# EasyEDA Pro project ProPrj_嵌赛国赛_2025-08-15.epro, schematic Schematic6

## Sheets
1 P1: Board Name: 审核板子; Create Date: 2025-07-23; Page Name: P1; Project Name: 嵌赛国赛; Schematic Name: Schematic6; Update Date: 2025-07-24; Company: 嘉立创EDA; Page Size: A4; Version: V1.0
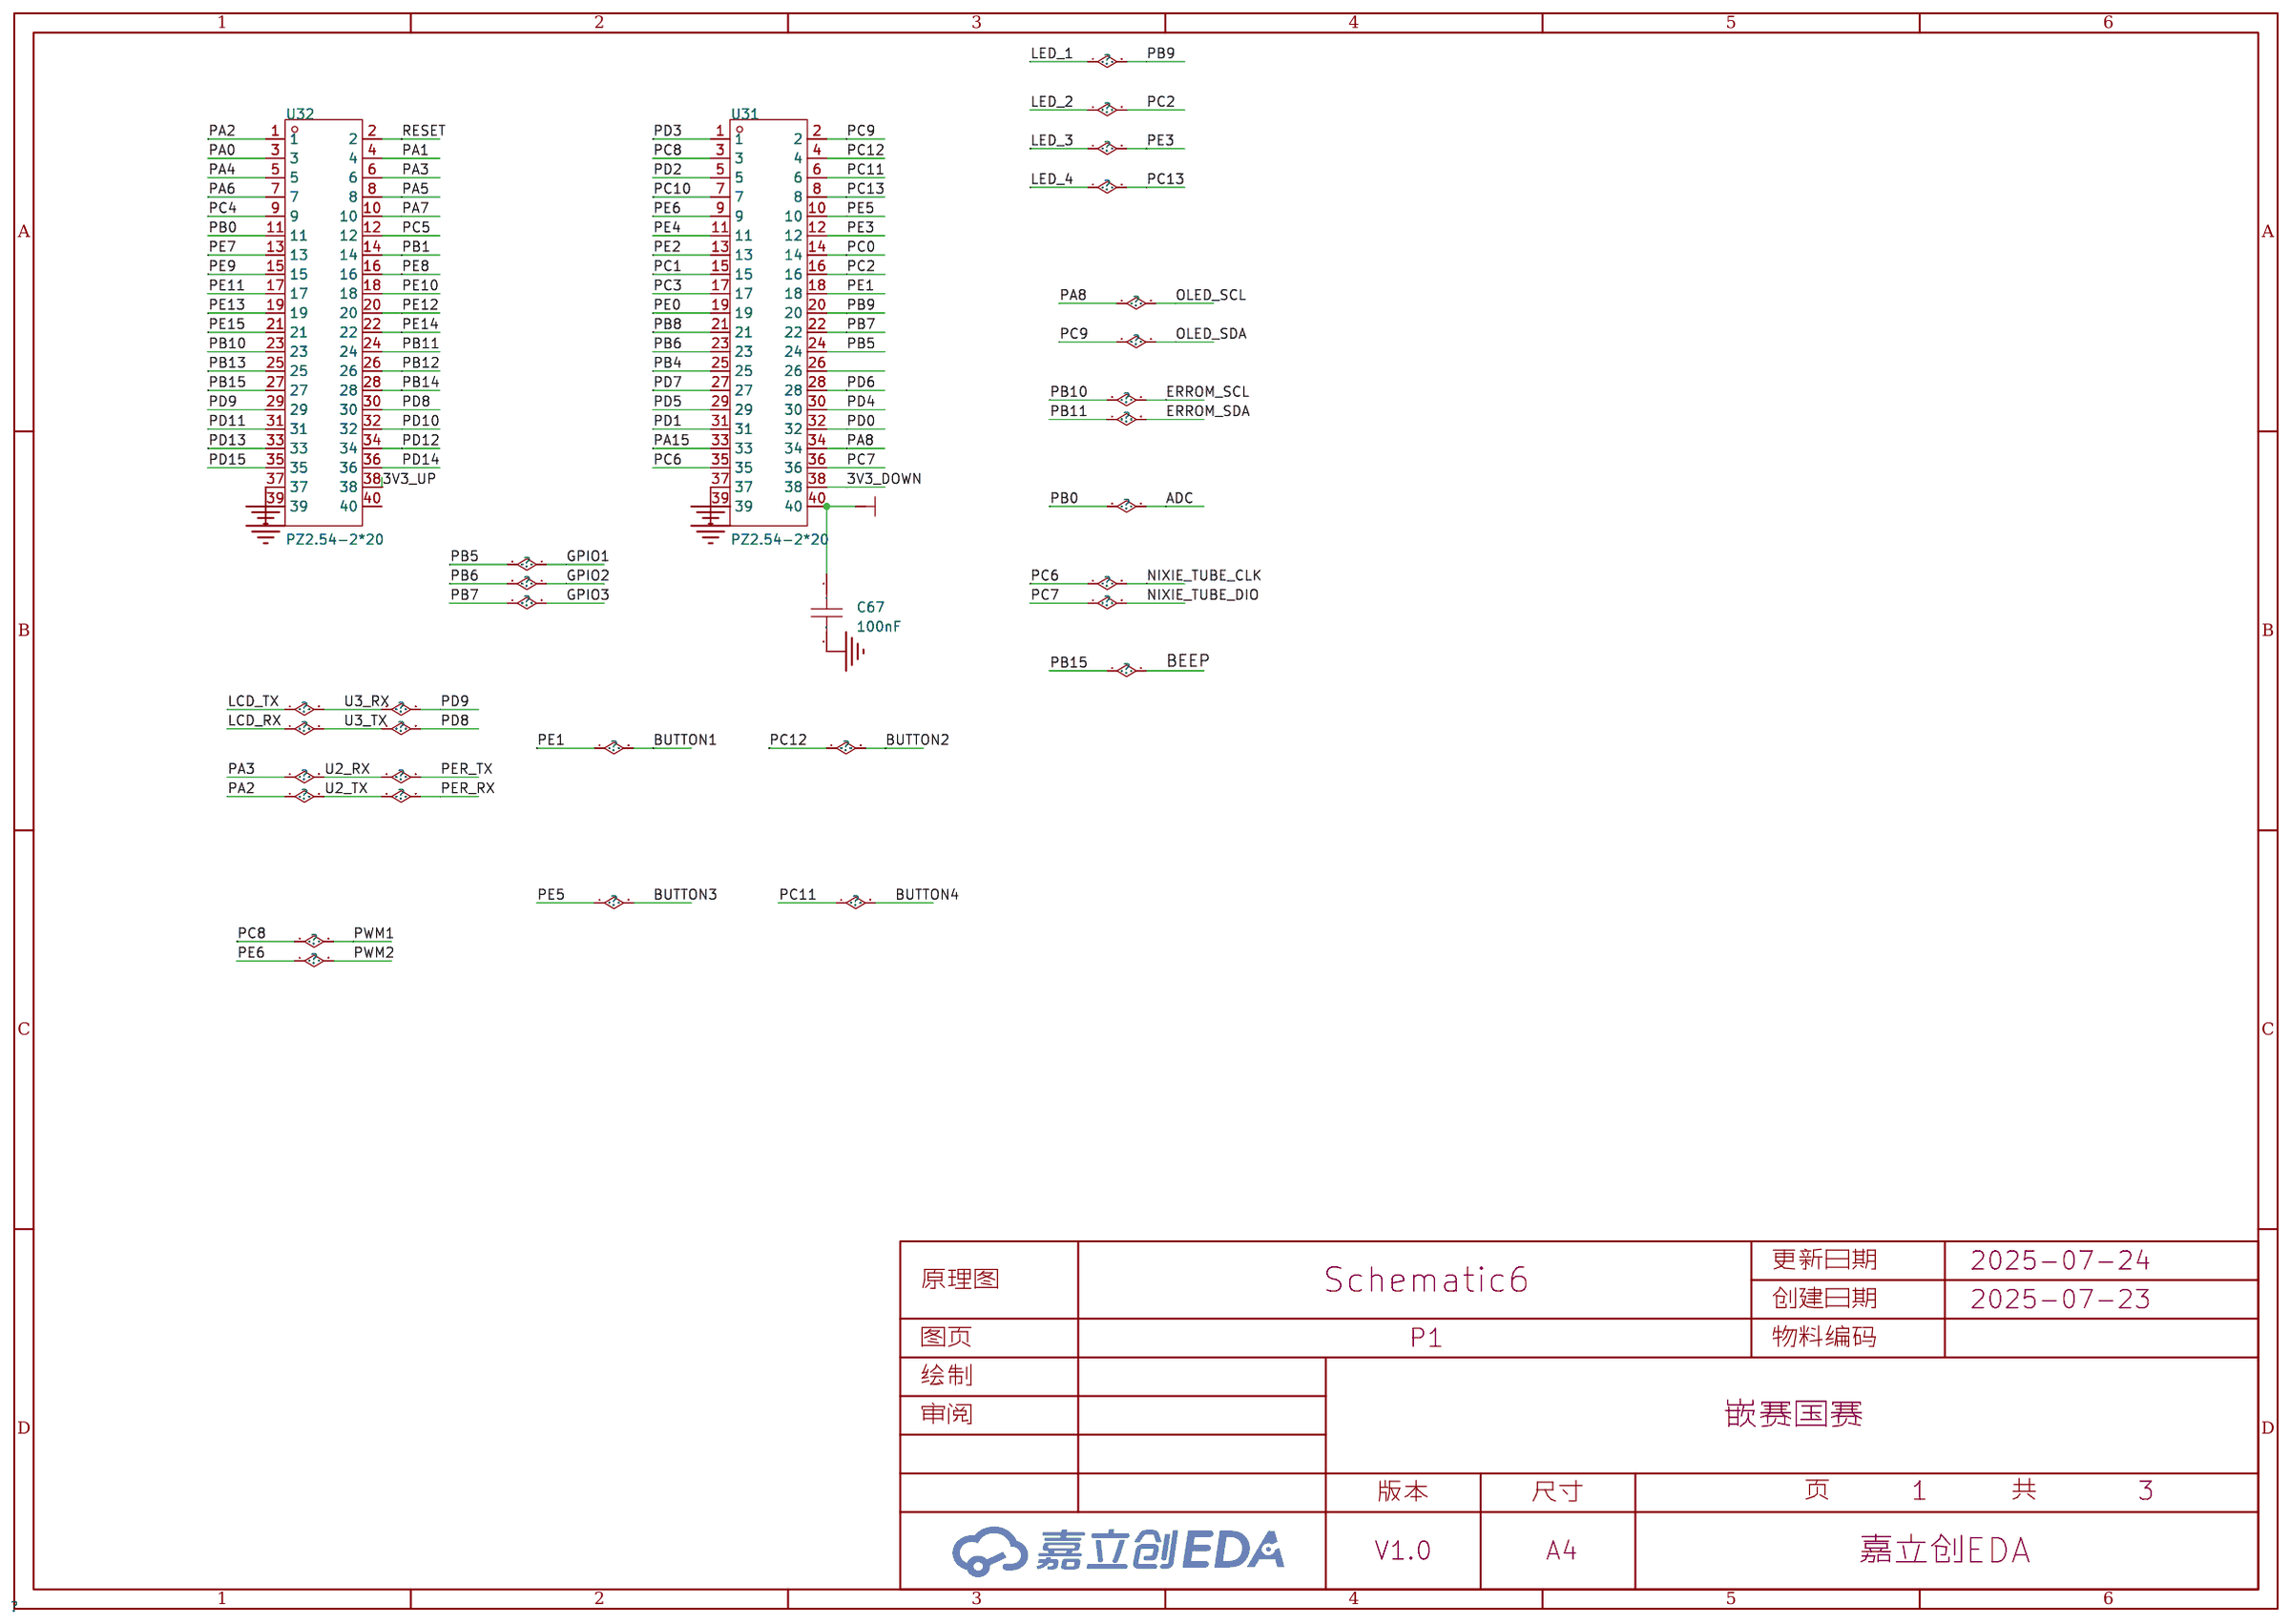
[diagram p11: P1]
2 外设: Page Name: 外设
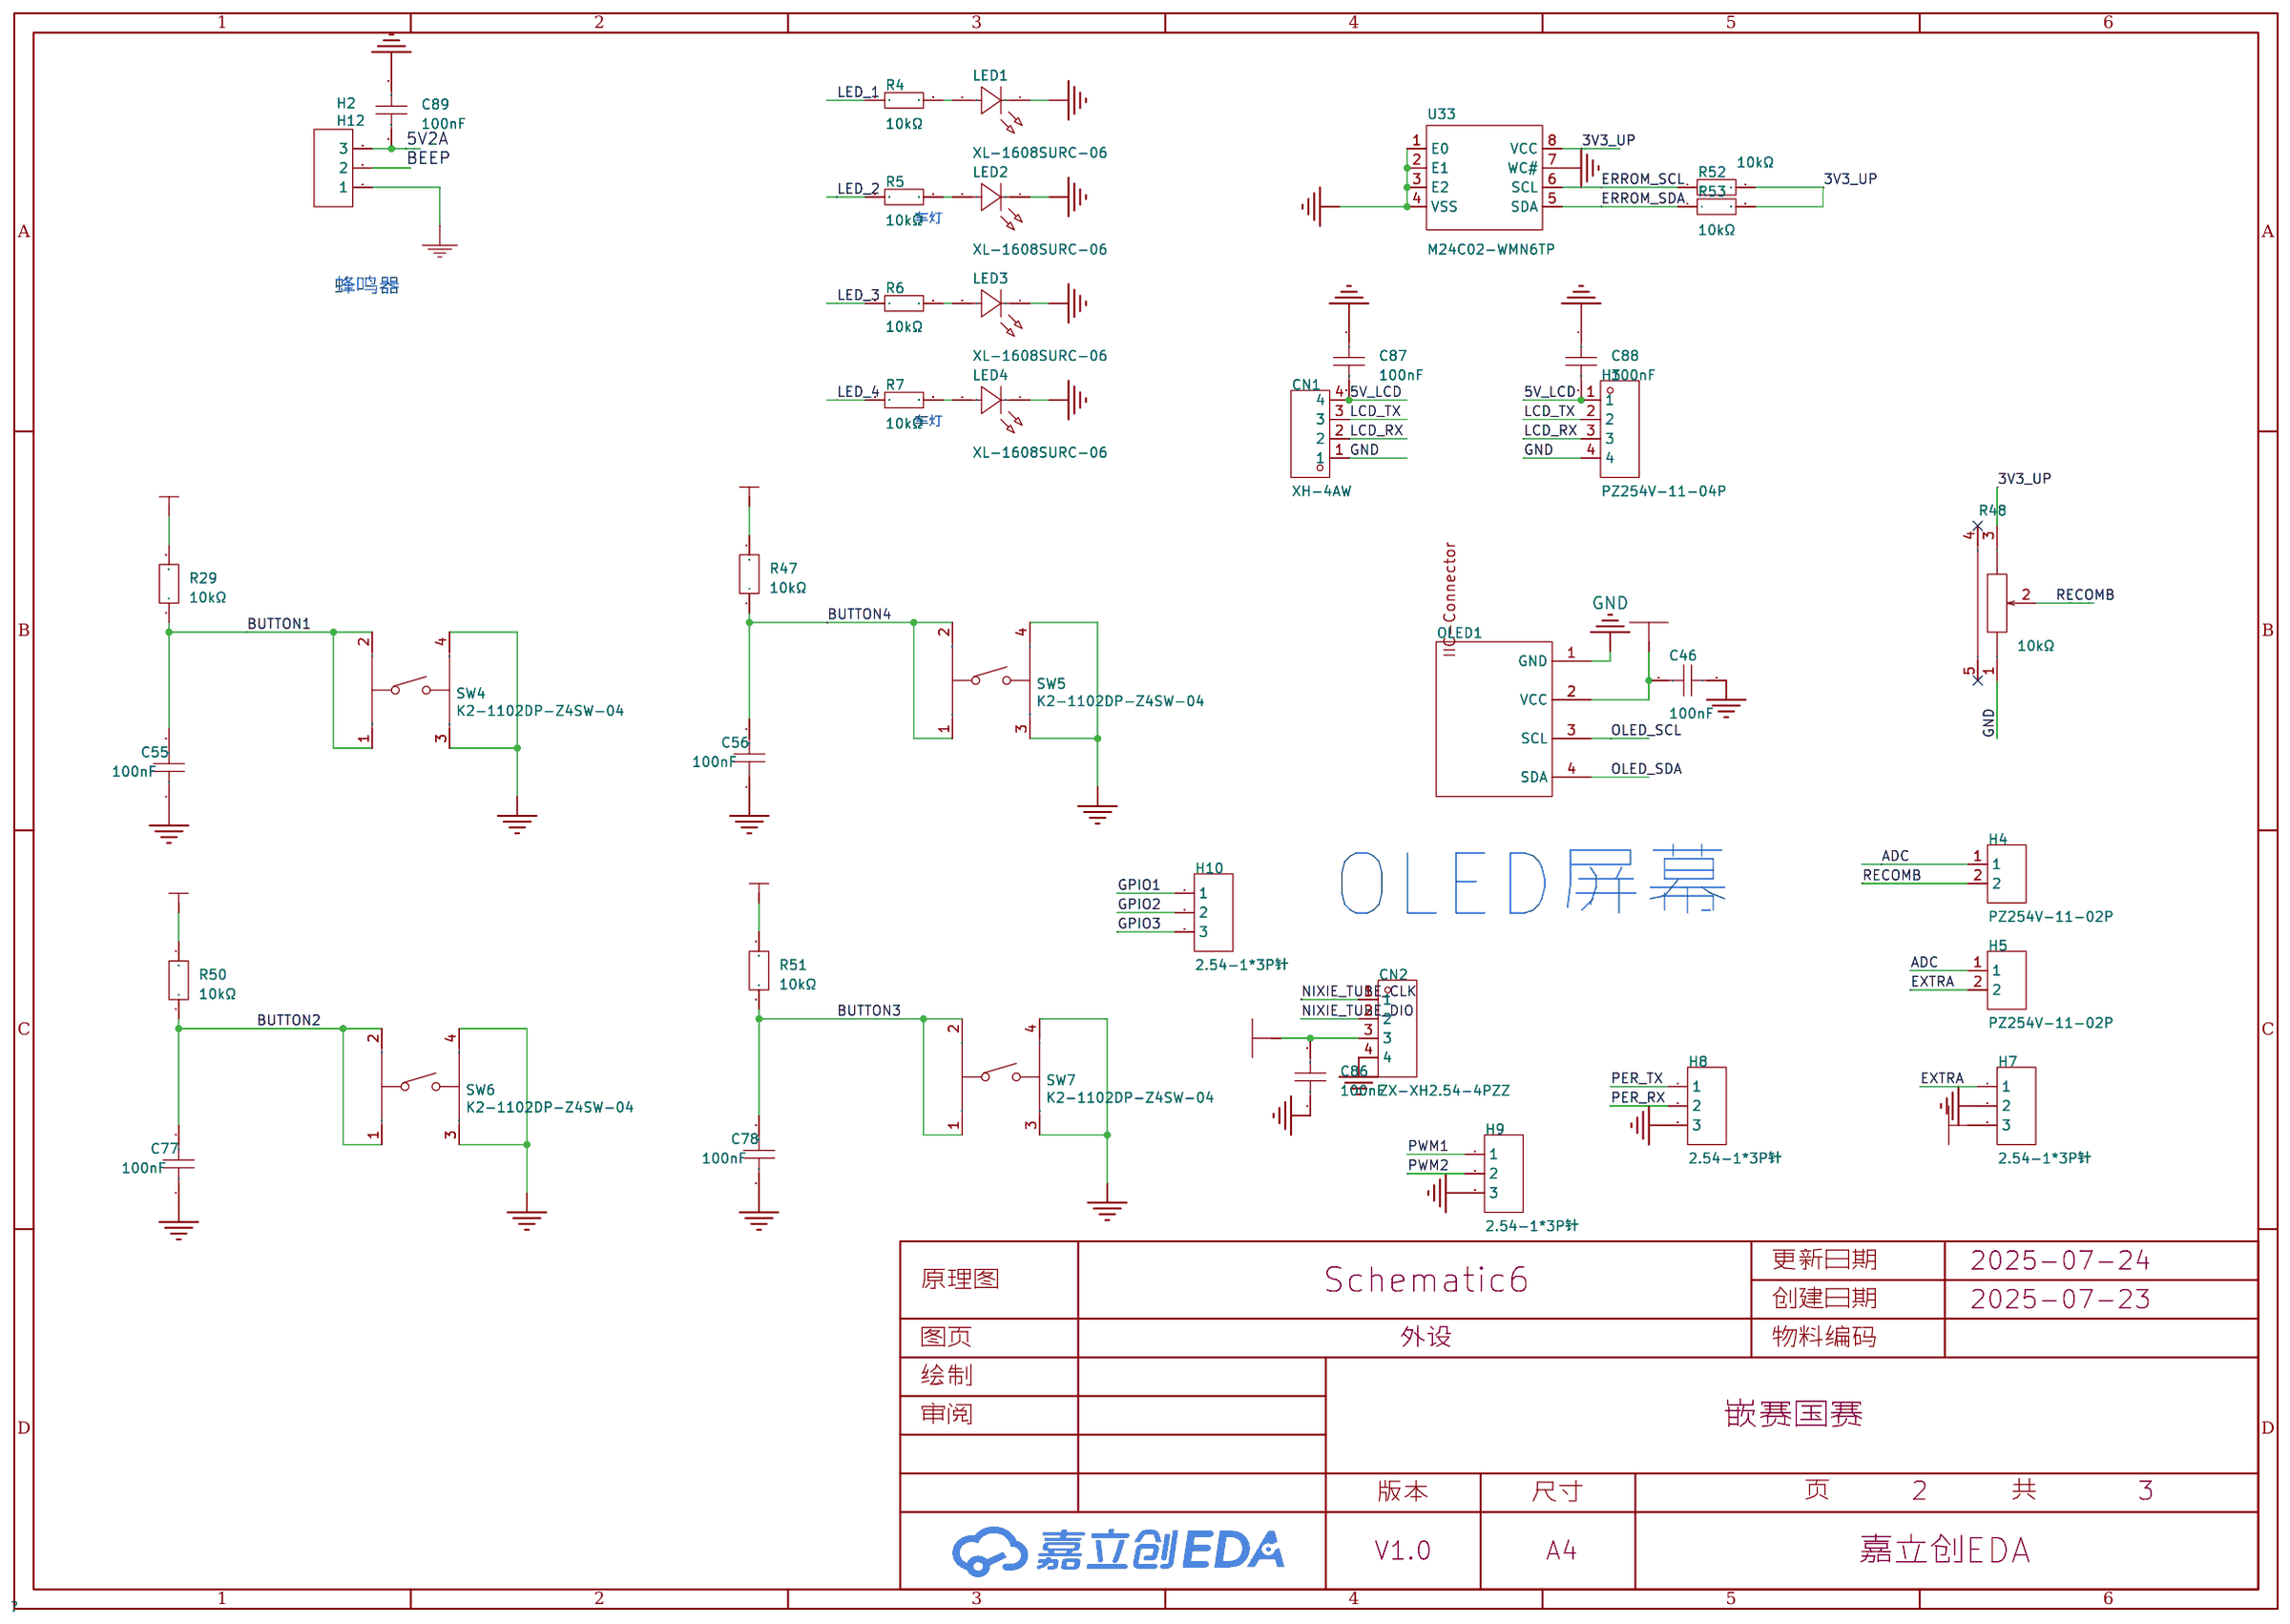
[diagram p12: 外设]
3 P3: Page Name: P3; Update Date: 2025-07-23
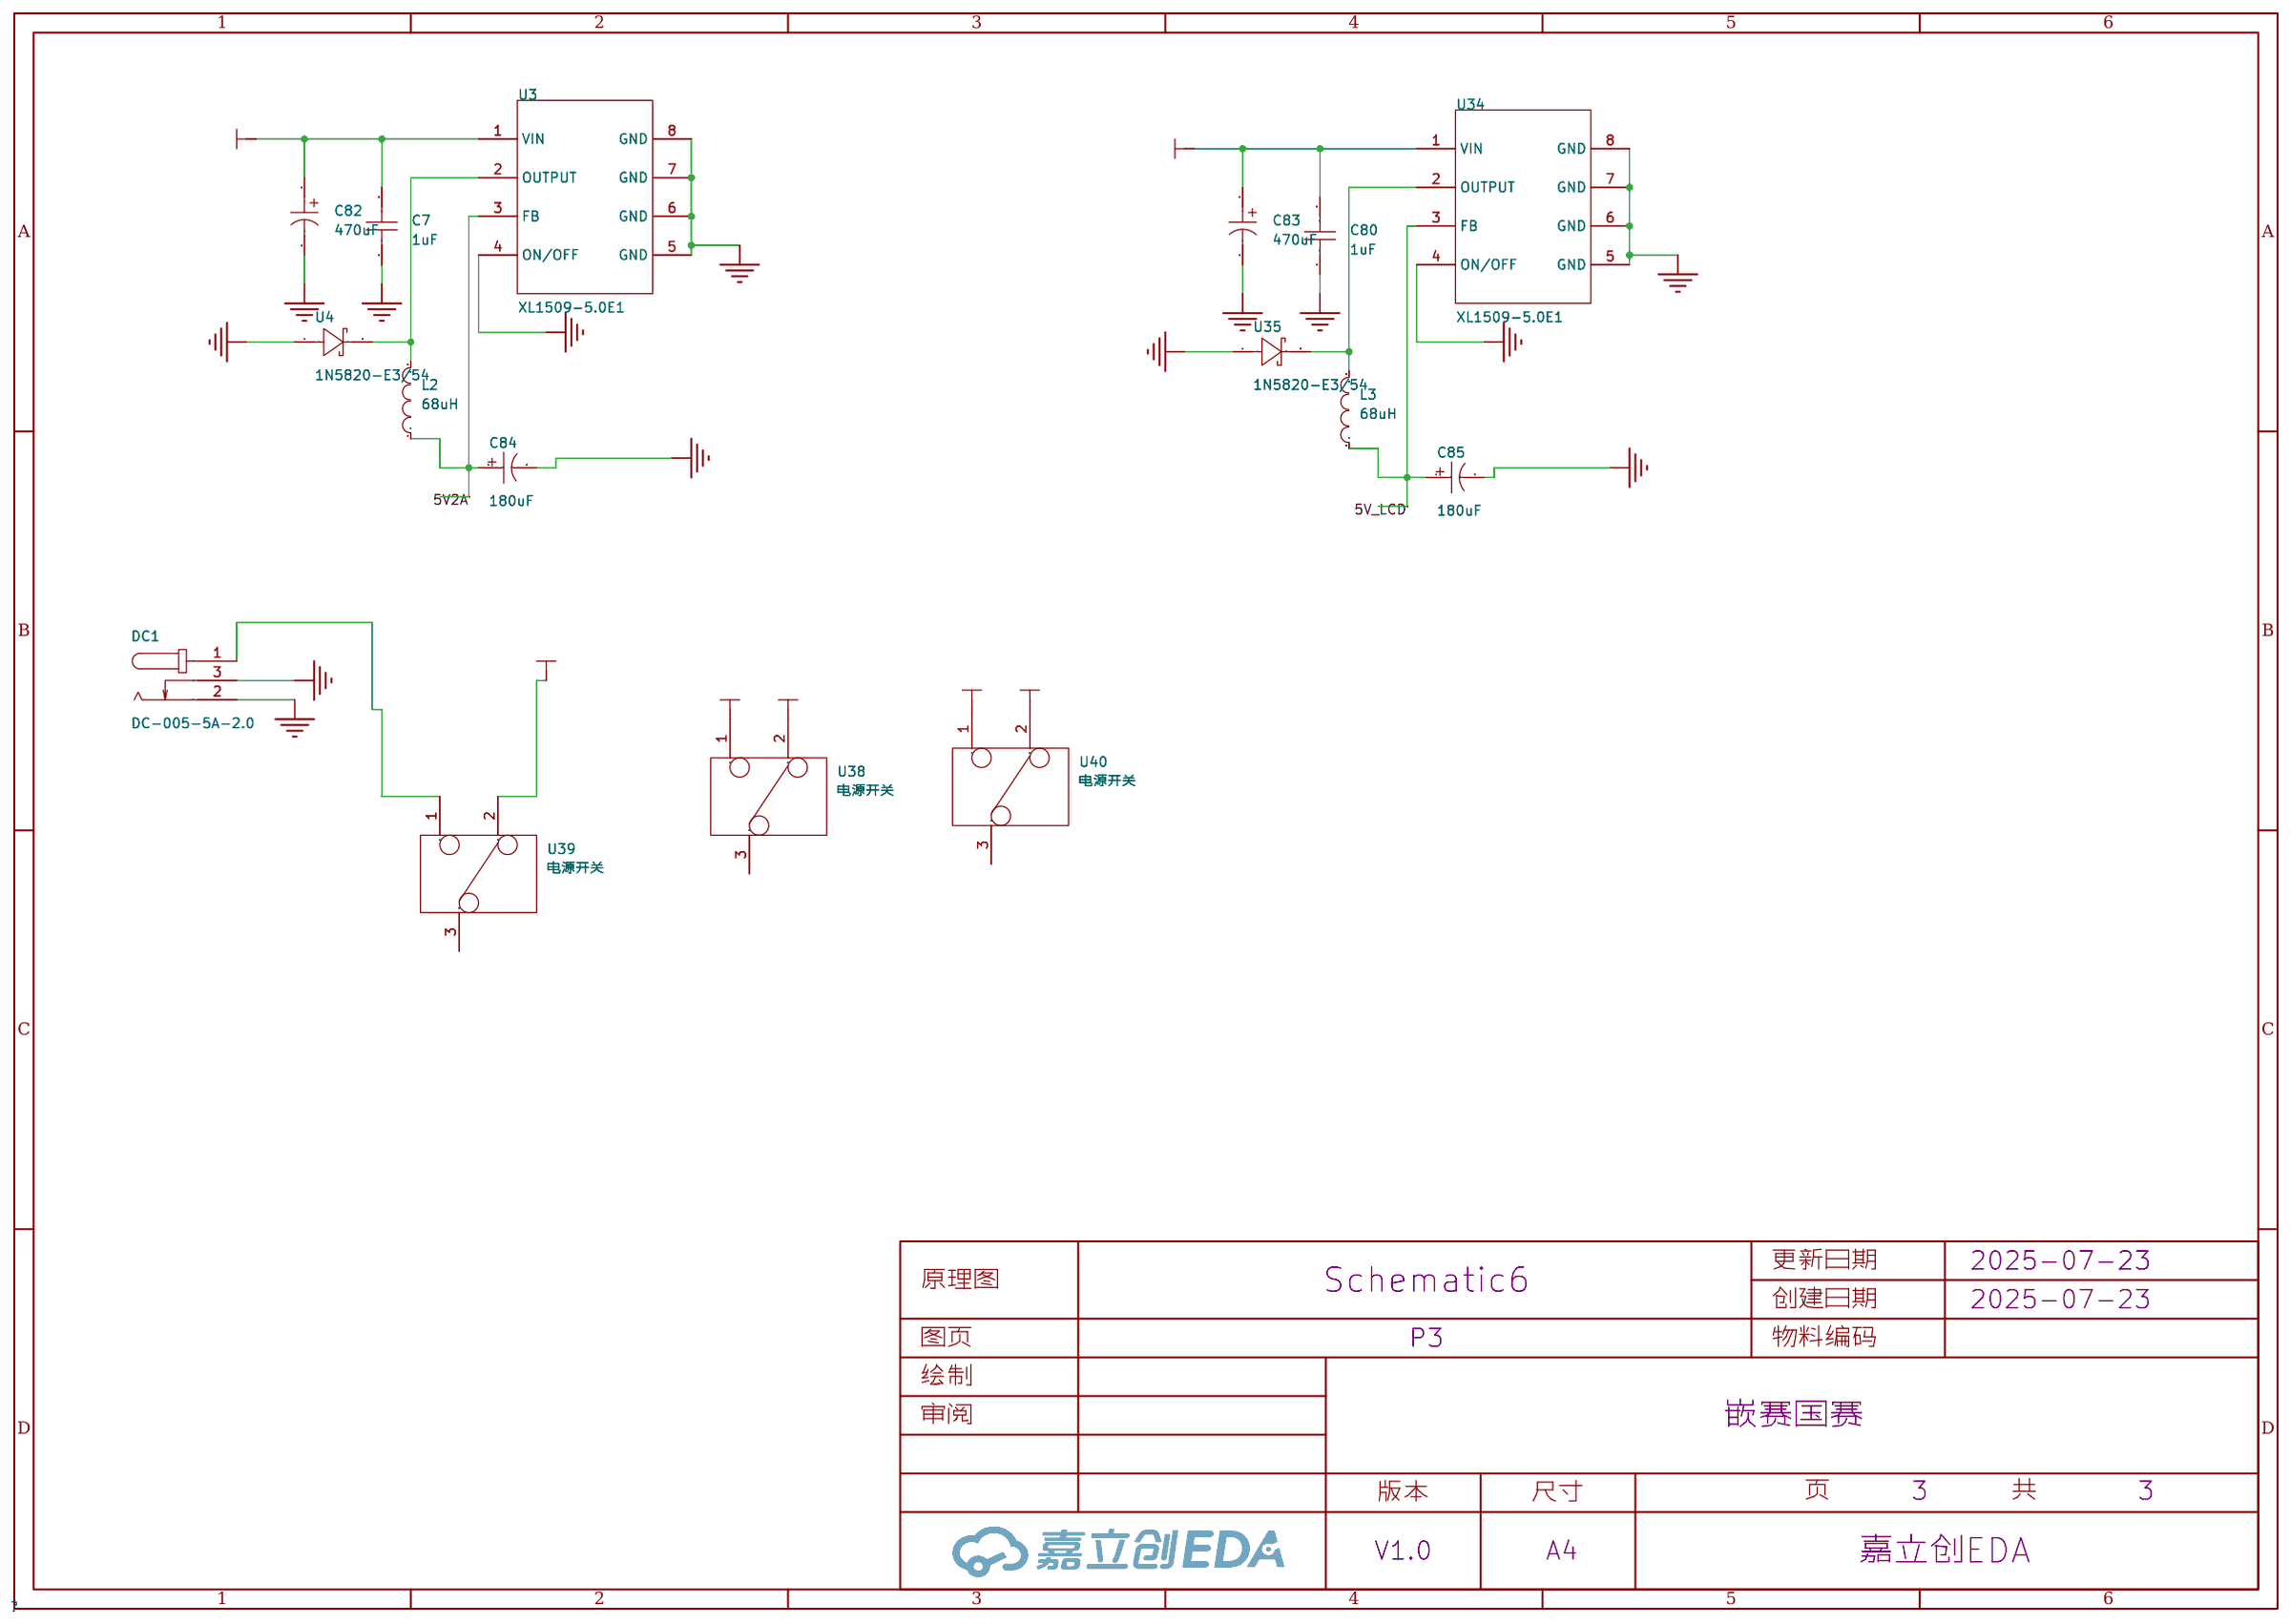
[diagram p13: P3]

## Parts
sheet P1
C67  100nF  [C0603]
U31  PZ2.54-2*20  [HDR-TH_40P-P2.54-V-M-R2-C20-S2.54]
U32  PZ2.54-2*20  [HDR-TH_40P-P2.54-V-M-R2-C20-S2.54]
sheet P3
C7  1uF  [C0603]
C80  1uF  [C0603]
C82  470uF  [CAP-SMD_BD10.0-L10.3-W10.3-LS11.0]
C83  470uF  [CAP-SMD_BD10.0-L10.3-W10.3-LS11.0]
C84  180uF  [CAP-SMD_BD6.3-L6.6-W6.6-FD]
C85  180uF  [CAP-SMD_BD6.3-L6.6-W6.6-FD]
DC1  DC-005-5A-2.0  [DC-IN-TH_DC-005-5A-2.0]
L2  68uH  [IND-SMD_L7.1-W6.6-1]
L3  68uH  [IND-SMD_L7.1-W6.6-1]
U3  XL1509-5.0E1  [SOIC-8_L5.0-W4.0-P1.27-LS6.0-BL]
U4  1N5820-E3/54  [DO-201AD_BD5.3-L8.4-P12.50-D1.4-FD]
U34  XL1509-5.0E1  [SOIC-8_L5.0-W4.0-P1.27-LS6.0-BL]
U35  1N5820-E3/54  [DO-201AD_BD5.3-L8.4-P12.50-D1.4-FD]
U38  电源开关  [电源开关]
U39  电源开关  [电源开关]
U40  电源开关  [电源开关]
sheet 外设
C46  100nF  [C0603]
C55  100nF  [C0603]
C56  100nF  [C0603]
C77  100nF  [C0603]
C78  100nF  [C0603]
C86  100nF  [C0603]
C87  100nF  [C0603]
C88  100nF  [C0603]
C89  100nF  [C0603]
CN1  XH-4AW  [CONN-TH_XH-4AW]
CN2  ZX-XH2.54-4PZZ  [CONN-TH_4P-P2.50_4PIN]
H2  H12  [HDR-M-2.54_1X3]
H3  PZ254V-11-04P  [HDR-TH_4P-P2.54-V-M]
H4  PZ254V-11-02P  [HDR-TH_2P-P2.54-V-M]
H5  PZ254V-11-02P  [HDR-TH_2P-P2.54-V-M]
H7  2.54-1*3P针  [HDR-TH_3P-P2.54-V-M-1]
H8  2.54-1*3P针  [HDR-TH_3P-P2.54-V-M-1]
H9  2.54-1*3P针  [HDR-TH_3P-P2.54-V-M-1]
H10  2.54-1*3P针  [HDR-TH_3P-P2.54-V-M-1]
LED1  XL-1608SURC-06  [LED0603-RD_RED]
LED2  XL-1608SURC-06  [LED0603-RD_RED]
LED3  XL-1608SURC-06  [LED0603-RD_RED]
LED4  XL-1608SURC-06  [LED0603-RD_RED]
OLED1  -  [0.96OLED_4P]
R4  10kΩ  [R0805]
R5  10kΩ  [R0805]
R6  10kΩ  [R0805]
R7  10kΩ  [R0805]
R29  10kΩ  [R0603]
R47  10kΩ  [R0603]
R48  10kΩ  [res-adj-th_rk09k1130a5r]
R50  10kΩ  [R0603]
R51  10kΩ  [R0603]
R52  10kΩ  [R0603]
R53  10kΩ  [R0603]
SW4  K2-1102DP-Z4SW-04  [SW-TH_4P-L6.0-W6.0-P4.50-LS6.5]
SW5  K2-1102DP-Z4SW-04  [SW-TH_4P-L6.0-W6.0-P4.50-LS6.5]
SW6  K2-1102DP-Z4SW-04  [SW-TH_4P-L6.0-W6.0-P4.50-LS6.5]
SW7  K2-1102DP-Z4SW-04  [SW-TH_4P-L6.0-W6.0-P4.50-LS6.5]
U33  M24C02-WMN6TP  [SOIC-8_L4.9-W3.9-P1.27-LS6.0-BL]

## Library data of the parts
C46 C55 C56 C67 C77 C78 C86-C89 = CC0603KRX7R9BB104: 容值:100nF;精度:±10%;额定电压:50V;材质(温度系数):X7R;; LCSC Part Name: 100nF ±10% 50V; Supplier Part: C14663; Manufacturer: YAGEO(国巨); Supplier Footprint: 0603; JLCPCB Part Class: 基础库; Datasheet: https://atta.szlcsc.com/upload/public/pdf/source/20180910/C282072_33301C7F631E79921B82A8DAC6BCC5B3.pdf; Supplier: LCSC; Tolerance: ±10%; Voltage Rated: 50V; Temperature Coefficient: X7R
U31 U32 = PZ2.54-2*20: 插针结构:2x20P;间距:2.54mm;安装类型:直插;排数:双排;总PIN位数:40P;触头镀层:金;; Supplier Part: C5224014; Manufacturer: ZHOURI(洲日); Supplier Footprint: 插件,P=2.54mm; JLCPCB Part Class: Extended Part; Datasheet: https://atta.szlcsc.com/upload/public/pdf/source/20221102/7E8316C38DB6D81BB18273F4CFF8B2F6.pdf; Supplier: LCSC; Pin Structure: 2x20P; Pitch: 2.54mm; Mounting Type: 直插; Number of Rows: 双排; Number of Pins: 40P; Contact Plating: 金
C7 C80 = CGA0603X5R105K160JT: 容值:1uF;精度:±10%;额定电压:16V;材质(温度系数):X5R;; LCSC Part Name: 1uF ±10% 16V; Supplier Part: C6119849; Manufacturer: HRE(芯声); Supplier Footprint: 0603; JLCPCB Part Class: 扩展库; Supplier: LCSC; Tolerance: ±10%; Voltage Rated: 16V; Temperature Coefficient: X5R
C82 C83 = JVJ35V470M10x10: 容值:470uF;精度:±20%;额定电压:35V;纹波电流:320mA@120Hz;; LCSC Part Name: 470uF ±20% 35V; Supplier Part: C46550413; Manufacturer: 捷而瑞; Supplier Footprint: SMD,D10xL10.5mm; JLCPCB Part Class: 扩展库; Datasheet: https://atta.szlcsc.com/upload/public/pdf/source/20250526/372E583B5965CEB57A276EA554306514.pdf; Supplier: LCSC; Tolerance: ±20%; Voltage Rating: 35V; Ripple Current: 320mA@120Hz; Diameter: 10mm; Height - Seated (Max): 10.5mm; Lifetime: 2000hrs@105℃; Operating Temperature: -55℃~+105℃
C84 C85 = 16SVPF180M: 容值:180uF;精度:±20%;额定电压:16V;纹波电流:3.3A@100kHz;等效串联电阻:-;类型:聚合物;; LCSC Part Name: 180uF ±20% 16V; Supplier Part: C136277; Manufacturer: PANASONIC(松下); Supplier Footprint: SMD,D6.3xL5.9mm; JLCPCB Part Class: 扩展库; Datasheet: https://atta.szlcsc.com/upload/public/pdf/source/20180301/C178375_15198943930751383948.pdf; Supplier: LCSC; Tolerance: ±20%; Rated Voltage: 16V; Ripple Current: 3.3A@100kHz; Type: 聚合物; φD: 6.3mm; L: 5.9mm; Lifetime @ Temp: 5000hrs@105℃; Operating Temperature: -55℃~+105℃
DC1 = DC-005-5A-2.0: 连接器类型:DC电源插座;安装方式:弯插;触点内径:2mm;触点外径:6.2mm;额定电流:5A;额定电压:24V;工作温度范围:-20℃~+70℃;; LCSC Part Name: DC电源插座 内径:2mm 外径:6.2mm; Supplier Part: C381116; Manufacturer: XKB Connection(中国星坤); Supplier Footprint: 插件; JLCPCB Part Class: 扩展库; Datasheet: https://atta.szlcsc.com/upload/public/pdf/source/20211015/707A35F7AB6E89C57AAB641950105BB7.pdf; Supplier: LCSC; Connector Type: DC电源插座; Mounting Style: 弯插; Inside Contact Diameter: 2mm; Outside Contact Diameter: 6.2mm; Current Rating (Max): 5A; Voltage Rating (Max): 24V; Operating Temperature Range: -20℃~+70℃
L2 L3 = PSPMAA0605H-680M-IGF: 电感值:68uH;精度:±20%;额定电流:2A;饱和电流(Isat):2.5A;; LCSC Part Name: 68uH ±20% 2.5A; Supplier Part: C2983094; Manufacturer: PROD(谱罗德); Supplier Footprint: SMD,6.6x7.1mm; JLCPCB Part Class: 扩展库; Datasheet: https://atta.szlcsc.com/upload/public/pdf/source/20220421/FA7B36985F5EDDBED7850D2E38F6BF27.pdf; Supplier: LCSC; Tolerance: ±20%; Rated Current: 2A; Saturation Current (Isat): 2.5A; DC Resistance (DCR): 256mΩ; Ratings: AEC-Q200
U3 U34 = XL1509-5.0E1: 功能类型:降压型;输入电压:4.5V~40V;输出电流:2A;; LCSC Part Name: 2A 150KHz 40V 降压 DC-DC 转换器; Supplier Part: C61063; Manufacturer: XLSEMI(芯龙); Supplier Footprint: SOIC-8; JLCPCB Part Class: 基础库; Datasheet: https://atta.szlcsc.com/upload/public/pdf/source/20151126/1457707596805.pdf; Supplier: LCSC; Function: 降压型; Input Voltage: 4.5V~40V; Output Current: 2A; Switching Frequency: 150kHz; Operating Temperature: -40℃~+125℃@(TJ); Number of Outputs: 1; Topology: 降压式; Switch tube (built-in/external): 内置
U4 U35 = 1N5820-E3/54: 正向压降(Vf):475mV@3A;直流反向耐压(Vr):20V;整流电流:3A;; LCSC Part Name: 电压:20V 电流:3A; Supplier Part: C5357977; Manufacturer: VISHAY(威世); Supplier Footprint: DO-201AD; JLCPCB Part Class: Extended Part; Datasheet: https://atta.szlcsc.com/upload/public/pdf/source/20231213/4CD9FBE9F25054130E4EF21C8CAD5061.pdf; Supplier: LCSC; Forward Voltage (Vf@If): 475mV@3A; Reverse Voltage (Vr): 20V; Rectified Current: 3A; Reverse Leakage Current (Ir): 2mA@20V
U38-U40 = 电源开关
CN1 = XH-4AW: 插针结构:1x4P;间距:2.54mm;安装方式:弯插;参考系列:XH;总PIN数:4P;排数:1;每排PIN数:4;行距:-;额定电流:3A;触头材质:黄铜;触头镀层:锡;工作温度范围:-25℃~+85℃;; LCSC Part Name: 1x4P 间距:2.54mm 弯插 系列:XH; Supplier Part: C2908613; Manufacturer: HCTL(华灿天禄); Supplier Footprint: 弯插,P=2.5mm; JLCPCB Part Class: 扩展库; Datasheet: https://atta.szlcsc.com/upload/public/pdf/source/20230711/B565BAF3B11666EF6B81B3605408F2BD.pdf; Supplier: LCSC; Pins Structure: 1x4P; Pitch: 2.54mm; Mounting Style: 弯插; Reference Series: XH; Number of Pins: 4P; Number of Rows: 1; Number of PINs Per Row: 4; Current Rating (Max): 3A; Contact Material: 黄铜; Contact Plating: 锡; Operating Temperature Range: -25℃~+85℃
CN2 = ZX-XH2.54-4PZZ: 插针结构:1x4P;间距:2.5mm;安装方式:直插;参考系列:XH;总PIN数:4P;排数:1;每排PIN数:4;行距:-;额定电流:3A;触头材质:黄铜;触头镀层:锡;工作温度范围:-25℃~+85℃;; LCSC Part Name: 1x4P 间距:2.5mm 直插 系列:XH; Supplier Part: C7429634; Manufacturer: Megastar(兆星); Supplier Footprint: 插件,P=2.5mm; JLCPCB Part Class: 扩展库; Datasheet: https://atta.szlcsc.com/upload/public/pdf/source/20230619/B529A2163E0159A644AB3383D208FB03.pdf; Supplier: LCSC; Pins Structure: 1x4P; Pitch: 2.5mm; Mounting Type: 直插; Reference Series: XH; Number of Pins: 4P; Number of Rows: 1; Number of PINs Per Row: 4; Rated Current: 3A; Contact Material: 黄铜; Contact Plating: 锡; Operating Temperature: -25℃~+85℃; Rated Voltage (Max): 250V; Plastic Material: PA66; Flame Retardant Rating: UL94V-0; Color: 白色; Z-Height of the Board: 7mm; X-Length of Bottom Edge on Board (Spacing Line): 12.5mm; Y-Width of Bottom Edge on Board: 5.9mm
H2 = H12: Supplier Part: C180248; Supplier: LCSC
H3 = PZ254V-11-04P: 插针结构:1x4P;间距:2.54mm;行距:-;圆针/方针:方针;安装类型:直插;排数:单排;总PIN位数:4P;额定电流:3A;额定电压:250V;配合针长度:6mm;塑高:2.5mm;端接针长度:3mm;触头材质:-;工作温度范围:-40℃~+105℃;颜色:黑色;; LCSC Part Name: 间距:2.54mm 1x4P 直插 方针; Supplier Part: C2691448; Manufacturer: XFCN(兴飞); Supplier Footprint: 插件,P=2.54mm; JLCPCB Part Class: 扩展库; Datasheet: https://atta.szlcsc.com/upload/public/pdf/source/20200309/C492403_F9F19131791D08044AD4F84F8E751A34.pdf; Supplier: LCSC; Pin Structure: 1x4P; Pitch: 2.54mm; Circluar Pins/Square Pins: 方针; Mounting Type: 直插; Number of Rows: 单排; Number of Pins: 4P; Current Rating (Max): 3A; Voltage Rating (Max): 250V; Length of Mating Pin: 6mm; Insulation Height: 2.5mm; Length of End Connection Pin: 3mm; Operating Temperature Range: -40℃~+105℃; Color: 黑色
H4 H5 = PZ254V-11-02P: 插针结构:1x2P;间距:2.54mm;行距:-;圆针/方针:方针;安装方式:直插;排数:单排;总PIN位数:2P;额定电流:-;额定电压:-;配合针长度:6mm;塑高:2.5mm;端接针长度:3mm;触头材质:黄铜;触头镀层:-;工作温度:-40℃~+105℃;颜色:黑色;; LCSC Part Name: 1x2P 间距:2.54mm 方针 直插; Supplier Part: C492401; Manufacturer: XFCN(兴飞); Supplier Footprint: 插件,P=2.54mm; JLCPCB Part Class: Extended Part; Datasheet: https://atta.szlcsc.com/upload/public/pdf/source/20200309/C492401_A812433581A9B211A7FFA413ADDFF0E5.pdf; Supplier: LCSC; Pin Structure: 1x2P; Pitch: 2.54mm; Circluar Pins/Square Pins: 方针; Mounting Type: 直插; Number of Rows: 单排; Number of Pins: 2P; Length of Mating Pin: 6mm; Insulation Height: 2.5mm; Length of End Connection Pin: 3mm; Contact Material: 黄铜; Operating Temperature: -40℃~+105℃; Color: 黑色
H7-H10 = 2.54-1*3P针: 插针结构:1x3P;间距:2.54mm;行距:-;圆针/方针:方针;安装类型:直插;排数:单排;总PIN位数:3P;额定电流:3A;额定电压:-;配合针长度:-;塑高:-;端接针长度:-;触头材质:-;触头镀层:-;工作温度范围:-40℃~+105℃;颜色:黑色;; LCSC Part Name: 间距:2.54mm 1x3P 直插 方针; Supplier Part: C49257; Manufacturer: BOOMELE(博穆精密); Supplier Footprint: 插件,P=2.54mm; JLCPCB Part Class: 扩展库; Datasheet: https://atta.szlcsc.com/upload/public/pdf/source/20221018/3E9408392E35E6F57A28985E5F7BF5C9.pdf; Supplier: LCSC; Pin Structure: 1x3P; Pitch: 2.54mm; Circluar Pins/Square Pins: 方针; Mounting Type: 直插; Number of Rows: 单排; Number of Pins: 3P; Current Rating (Max): 3A; Operating Temperature Range: -40℃~+105℃; Color: 黑色
LED1-LED4 = XL-1608SURC-06: 发光颜色:红色;功率:55mW;正向电流:25mA;主波长:617nm~621nm;透镜颜色:无色透明透镜;色温:-;发光角度:120°;载带方式:正贴;工作温度:-30℃~+85℃;; Supplier Part: C965799; Manufacturer: XINGLIGHT(成兴光); Supplier Footprint: 0603; JLCPCB Part Class: 扩展库; Datasheet: https://atta.szlcsc.com/upload/public/pdf/source/20221102/D860AFDD1CDB02C5A8064103A32707E2.pdf; Supplier: LCSC; Emitted Color: 红色; Power Dissipation: 55mW; Forward Current: 25mA; Dominant Wavelength: 617nm~621nm; Peak Wavelength: 623nm; Lens Color: 无色透明透镜; Viewing Angle: 120°; Mounting Sytle: 正贴; Operating Temperature: -30℃~+85℃
OLED1 = 0.96OLED_4P: LCSC Part Name: 0.96OLED_4P_MODULE_JX; Supplier Part: C9900004566; Manufacturer Part: 0.96OLED_4P_MODULE_JX; Supplier Footprint: THrough hole; JLCPCB Part Class: Extended Part; Supplier: LCSC
R4-R7 = 0805W8J0103T5E: 电阻类型:厚膜电阻;阻值:10kΩ;精度:±5%;功率:125mW;最大工作电压:150V;温度系数:±100ppm/℃;; LCSC Part Name: 10kΩ ±5% 125mW 厚膜电阻; Supplier Part: C25612; Manufacturer: UNI-ROYAL(厚声); Supplier Footprint: 0805; JLCPCB Part Class: 扩展库; Datasheet: https://atta.szlcsc.com/upload/public/pdf/source/20200306/C422600_1E6D84923E4A46A82E41ADD87F860B5C.pdf; Supplier: LCSC; Type: 厚膜电阻; Tolerance: ±5%; Power(Watts): 125mW; Overload Voltage (Max): 150V; Temperature Coefficient: ±100ppm/℃; Operating Temperature Range: -55℃~+155℃
R29 R47 R50 R51 = FRC0603J103TS: 电阻类型:厚膜电阻;阻值:10kΩ;精度:±5%;功率:100mW;最大工作电压:75V;温度系数:±100ppm/℃;; LCSC Part Name: 10kΩ ±5% 100mW 厚膜电阻; Supplier Part: C2930027; Manufacturer: FOJAN(富捷); Supplier Footprint: 0603; JLCPCB Part Class: 扩展库; Datasheet: https://atta.szlcsc.com/upload/public/pdf/source/20211221/925EC7D7225764EE0046F22065062C87.pdf; Supplier: LCSC; Type: 厚膜电阻; Tolerance: ±5%; Power(Watts): 100mW; Overload Voltage (Max): 75V; Temperature Coefficient: ±100ppm/℃; Operating Temperature Range: -55℃~+155℃
R48 = RK09K1130A5R: 阻值:10kΩ;精度:±20%;; LCSC Part Name: 10kΩ ±20%; Supplier Part: C209779; Manufacturer: ALPSALPINE(阿尔卑斯阿尔派); Supplier Footprint: 插件; JLCPCB Part Class: 扩展库; Datasheet: https://atta.szlcsc.com/upload/public/pdf/source/20180404/C209779_144B5EF41D1B8507FF4660D0445AF581.pdf; Supplier: LCSC; Tolerance: ±20%
R52 R53 = 0603WAF1002T5E: 电阻类型:厚膜电阻;阻值:10kΩ;精度:±1%;功率:100mW;最大工作电压:75V;温度系数:±100ppm/℃;; LCSC Part Name: 厚膜电阻 10kΩ ±1% 100mW; Supplier Part: C25804; Manufacturer: UNI-ROYAL(厚声); Supplier Footprint: 0603; JLCPCB Part Class: Basic Part; Datasheet: https://atta.szlcsc.com/upload/public/pdf/source/20200306/C422600_1E6D84923E4A46A82E41ADD87F860B5C.pdf; Supplier: LCSC; Type: 厚膜电阻; Tolerance: ±1%; Power(Watts): 100mW; Overload Voltage (Max): 75V; Temperature Coefficient: ±100ppm/℃; Operating Temperature Range: -55℃~+155℃
SW4-SW7 = K2-1102DP-Z4SW-04: Supplier: LCSC; Supplier Part: C194449; Manufacturer: 韩国韩荣; JLCPCB Part Class: Extended Part
U33 = M24C02-WMN6TP: 接口类型:I2C;存储容量:2Kbit;; Supplier Part: C7562; Manufacturer: ST(意法半导体); Supplier Footprint: SOIC-8; JLCPCB Part Class: 扩展库; Datasheet: https://atta.szlcsc.com/upload/public/pdf/source/20140724/1457707167301.pdf; Supplier: LCSC; Interface Type: I2C; Memory Size: 2Kbit; Supply Voltage: 2.5V~5.5V; Write Cycle Time (Tw): 5ms; Data Retention - TDR (Year): 200年; Write Cycle Endurance: 1200000次; Operating Temperature: -40℃~+85℃

## Nets
3V3_DOWN: R29.2 R47.2 R50.2 R51.2 U31.38
3V3_UP: R48.3 R52.2 R53.2 U32.38 U33.8(VCC)
5V2A: C46.2 C67.1 C84.1 C86.2 C89.2 CN2.3 H2.3 H7.3 L2.1 OLED1.2(VCC) U3.3(FB) U31.40
5V_LCD: C85.1 C87.2 C88.2 CN1.4 H3.1 L3.1 U34.3(FB)
12V: U38.1 U39.2 U40.1
12VCOMMON: C7.2 C82.1 U3.1(VIN) U38.2
12VLCD: C80.2 C83.1 U34.1(VIN) U40.2
GND: C7.1 C46.1 C55.1 C56.1 C67.2 C77.1 C78.1 C80.1 C82.2 C83.2 C84.2 C85.2 C86.1 C87.1 C88.1 C89.1 CN1.1 CN2.4 DC1.2 DC1.3 H2.1 H3.4 H7.2 H8.3 H9.3 LED1.1(K) LED2.1(K) LED3.1(K) LED4.1(K) OLED1.1(GND) R48.1 SW4.3 SW4.4 SW5.3 SW5.4 SW6.3 SW6.4 SW7.3 SW7.4 U3.4(ON/OFF) U3.5(GND) U3.6(GND) U3.7(GND) U3.8(GND) U4.1(A) U31.37 U31.39 U32.37 U32.39 U33.1(E0) U33.2(E1) U33.3(E2) U33.4(VSS) U33.7(WC#) U34.4(ON/OFF) U34.5(GND) U34.6(GND) U34.7(GND) U34.8(GND) U35.1(A)
ADC: H4.1 H5.1 U32.11
BEEP: H2.2 U32.27
BUTTON1: C55.2 R29.1 SW4.1 SW4.2 U31.18
BUTTON2: C77.2 R50.1 SW6.1 SW6.2 U31.4
BUTTON3: C78.2 R51.1 SW7.1 SW7.2 U31.10
BUTTON4: C56.2 R47.1 SW5.1 SW5.2 U31.6
ERROM_SCL: R52.1 U32.23 U33.6(SCL)
ERROM_SDA: R53.1 U32.24 U33.5(SDA)
EXTRA: H5.2 H7.1
GPIO1: H10.1 U31.24
GPIO2: H10.2 U31.23
GPIO3: H10.3 U31.22
LCD_RX: CN1.2 H3.3 U32.30
LCD_TX: CN1.3 H3.2 U32.29
LED_1: R4.1 U31.20
LED_2: R5.1 U31.16
LED_3: R6.1 U31.12
LED_4: R7.1 U31.8
NIXIE_TUBE_CLK: CN2.1 U31.35
NIXIE_TUBE_DIO: CN2.2 U31.36
OLED_SCL: OLED1.3(SCL) U31.34
OLED_SDA: OLED1.4(SDA) U31.2
PA0: U32.3
PA1: U32.4
PA2: H8.2 U32.1
PA3: H8.1 U32.6
PA4: U32.5
PA5: U32.8
PA6: U32.7
PA7: U32.10
PA15: U31.33
PB1: U32.14
PB4: U31.25
PB8: U31.21
PB12: U32.26
PB13: U32.25
PB14: U32.28
PC0: U31.14
PC1: U31.15
PC3: U31.17
PC4: U32.9
PC5: U32.12
PC8: H9.1 U31.3
PC10: U31.7
PD0: U31.32
PD1: U31.31
PD2: U31.5
PD3: U31.1
PD4: U31.30
PD5: U31.29
PD6: U31.28
PD7: U31.27
PD10: U32.32
PD11: U32.31
PD12: U32.34
PD13: U32.33
PD14: U32.36
PD15: U32.35
PE0: U31.19
PE2: U31.13
PE4: U31.11
PE6: H9.2 U31.9
PE7: U32.13
PE8: U32.16
PE9: U32.15
PE10: U32.18
PE11: U32.17
PE12: U32.20
PE13: U32.19
PE14: U32.22
PE15: U32.21
RECOMB: H4.2 R48.2
RESET: U32.2
$2N1048: LED1.2(A) R4.2
$2N1052: LED2.2(A) R5.2
$2N1056: LED3.2(A) R6.2
$2N1060: LED4.2(A) R7.2
$3N401: L2.2 U3.2(OUTPUT) U4.2(C)
$3N750: L3.2 U34.2(OUTPUT) U35.2(C)
$3N969: DC1.1 U39.1

Not connected (* = marked no-connect by the designer): R48 4(EH)* 5(EH)*; U31 26; U32 40; U38 3; U39 3; U40 3

## Notes on the sheets
sheet 2
- 车灯
- 蜂鸣器
- 车灯
- OLED屏幕
